# Altium schematic sheet LevelShiftingExtGPIO.SchDoc
size A4; CompanyName: Technische Hochschule Nürnberg Georg Simon Ohm; Organization: UltraZohm; Address1: Kesslerplatz 12; Address2: 90489 Nürnberg; Address3: GERMANY; Website: www.ultrazohm.com
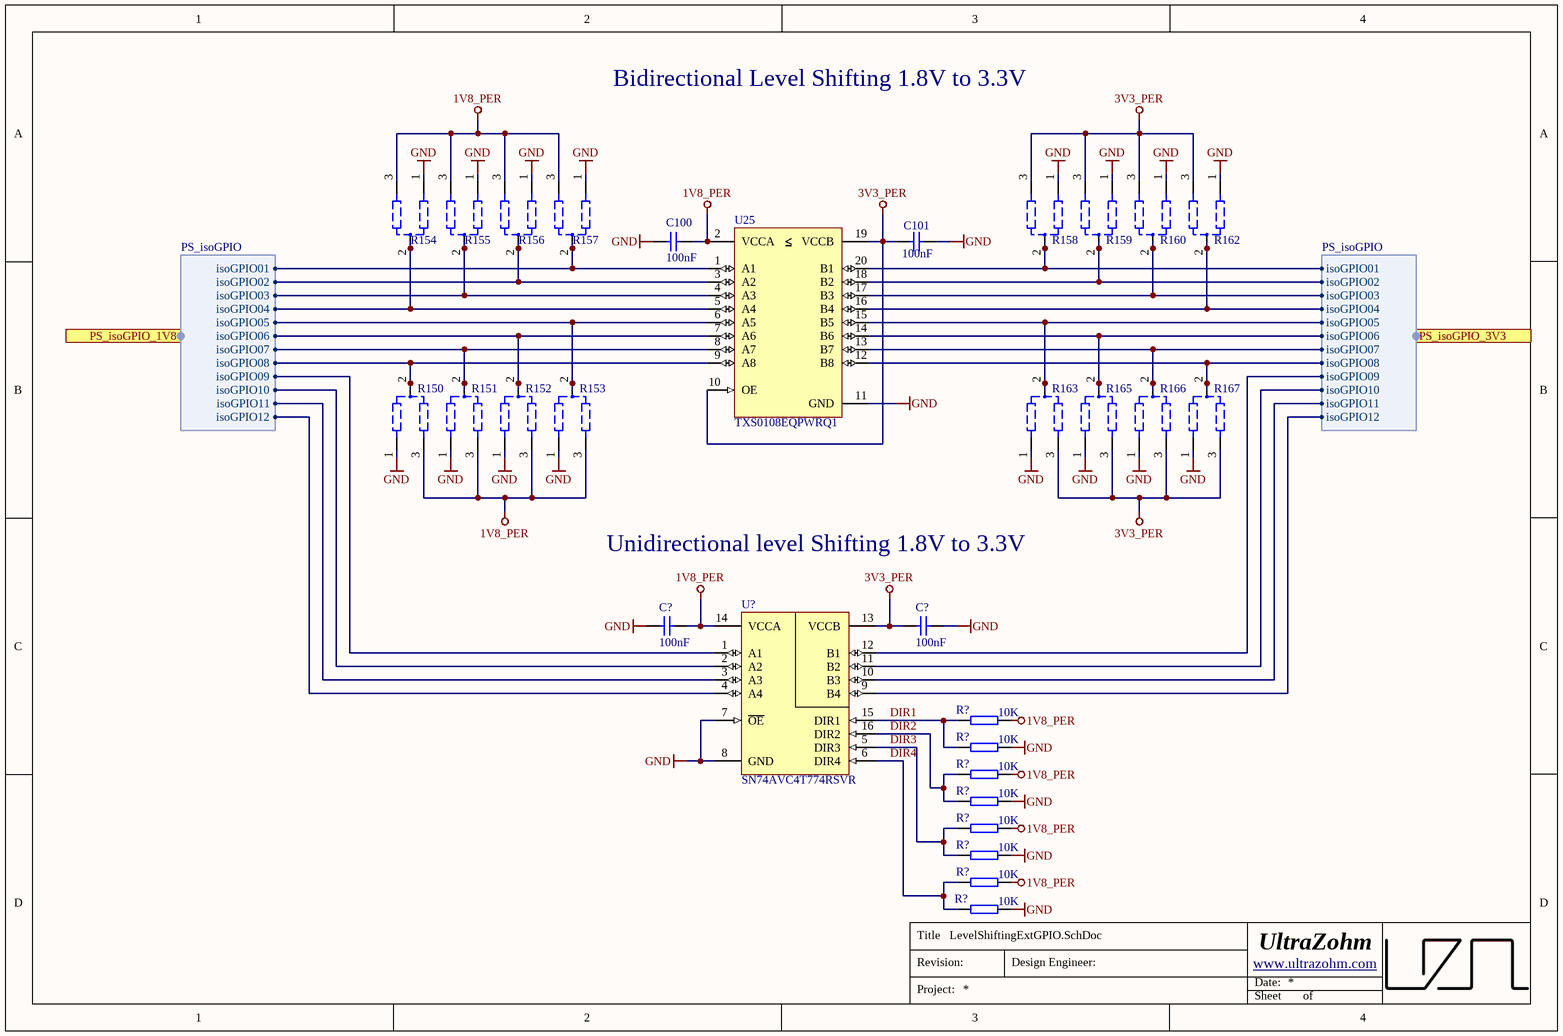
[diagram p0: LevelShiftingExtGPIO.SchDoc]

## Parts
(Parts that share a designator on the sheet are numbered #1, #2 ... from top to bottom, then left to right.)
C100  100nF  [CAPC1608X90N_V]
C101  100nF  [CAPC1608X90N_V]
C?#1  100nF  [CAPC1608X90N_V]
C?#2  100nF  [CAPC1608X90N_V]
R150  Manual Assembly 1608 (0603)  [TP_DUAL_RES_0603]  (value not drawn)  (no BOM)
R151  Manual Assembly 1608 (0603)  [TP_DUAL_RES_0603]  (value not drawn)  (no BOM)
R152  Manual Assembly 1608 (0603)  [TP_DUAL_RES_0603]  (value not drawn)  (no BOM)
R153  Manual Assembly 1608 (0603)  [TP_DUAL_RES_0603]  (value not drawn)  (no BOM)
R154  Manual Assembly 1608 (0603)  [TP_DUAL_RES_0603]  (value not drawn)  (no BOM)
R155  Manual Assembly 1608 (0603)  [TP_DUAL_RES_0603]  (value not drawn)  (no BOM)
R156  Manual Assembly 1608 (0603)  [TP_DUAL_RES_0603]  (value not drawn)  (no BOM)
R157  Manual Assembly 1608 (0603)  [TP_DUAL_RES_0603]  (value not drawn)  (no BOM)
R158  Manual Assembly 1608 (0603)  [TP_DUAL_RES_0603]  (value not drawn)  (no BOM)
R159  Manual Assembly 1608 (0603)  [TP_DUAL_RES_0603]  (value not drawn)  (no BOM)
R160  Manual Assembly 1608 (0603)  [TP_DUAL_RES_0603]  (value not drawn)  (no BOM)
R162  Manual Assembly 1608 (0603)  [TP_DUAL_RES_0603]  (value not drawn)  (no BOM)
R163  Manual Assembly 1608 (0603)  [TP_DUAL_RES_0603]  (value not drawn)  (no BOM)
R165  Manual Assembly 1608 (0603)  [TP_DUAL_RES_0603]  (value not drawn)  (no BOM)
R166  Manual Assembly 1608 (0603)  [TP_DUAL_RES_0603]  (value not drawn)  (no BOM)
R167  Manual Assembly 1608 (0603)  [TP_DUAL_RES_0603]  (value not drawn)  (no BOM)
R?#1  10K  [RESC1608X55N_V]
R?#2  10K  [RESC1608X55N_V]
R?#3  10K  [RESC1608X55N_V]
R?#4  10K  [RESC1608X55N_V]
R?#5  10K  [RESC1608X55N_V]
R?#6  10K  [RESC1608X55N_V]
R?#7  10K  [RESC1608X55N_V]
R?#8  10K  [RESC1608X55N_V]
U25  TXS0108EQPWRQ1  [SOP65P640X120-20N]
U?  SN74AVC4T774RSVR  [QFN40P260X180X55-16N]

## Ports
PS_isoGPIO_1V8 (harness PS_isoGPIO), PS_isoGPIO_3V3 (harness PS_isoGPIO)

## Harnesses
PS_isoGPIO: isoGPIO01, isoGPIO02, isoGPIO03, isoGPIO05, isoGPIO04, isoGPIO07, isoGPIO08, isoGPIO09, isoGPIO06, isoGPIO10, isoGPIO11, isoGPIO12

## Nets
1V8_PER: C100.1 C?#1.1 R150.3 R151.3 R152.3 R153.3 R154.3 R155.3 R156.3 R157.3 R?#1.2 R?#3.2 R?#5.2 R?#7.2 U25.2(VCCA) U?.14(VCCA)
3V3_PER: C101.1 C?#2.2 R158.3 R159.3 R160.3 R162.3 R163.3 R165.3 R166.3 R167.3 U25.10(OE) U25.19(VCCB) U?.13(VCCB)
GND: C100.2 C101.2 C?#1.2 C?#2.1 R150.1 R151.1 R152.1 R153.1 R154.1 R155.1 R156.1 R157.1 R158.1 R159.1 R160.1 R162.1 R163.1 R165.1 R166.1 R167.1 R?#2.2 R?#4.2 R?#6.2 R?#8.2 U25.11(GND) U?.7(~{OE}) U?.8(GND)
DIR1: R?#1.1 R?#2.1 U?.15(DIR1)
DIR2: R?#3.1 R?#4.1 U?.16(DIR2)
DIR3: R?#5.1 R?#6.1 U?.5(DIR3)
DIR4: R?#7.1 R?#8.1 U?.6(DIR4)
NetR150_2: R150.2 U25.9(A8) ; port PS_isoGPIO_1V8.isoGPIO08
NetR151_2: R151.2 U25.8(A7) ; port PS_isoGPIO_1V8.isoGPIO07
NetR152_2: R152.2 U25.7(A6) ; port PS_isoGPIO_1V8.isoGPIO06
NetR153_2: R153.2 U25.6(A5) ; port PS_isoGPIO_1V8.isoGPIO05
NetR154_2: R154.2 U25.5(A4) ; port PS_isoGPIO_1V8.isoGPIO04
NetR155_2: R155.2 U25.4(A3) ; port PS_isoGPIO_1V8.isoGPIO03
NetR156_2: R156.2 U25.3(A2) ; port PS_isoGPIO_1V8.isoGPIO02
NetR157_2: R157.2 U25.1(A1) ; port PS_isoGPIO_1V8.isoGPIO01
NetR158_2: R158.2 U25.20(B1) ; port PS_isoGPIO_3V3.isoGPIO01
NetR159_2: R159.2 U25.18(B2) ; port PS_isoGPIO_3V3.isoGPIO02
NetR160_2: R160.2 U25.17(B3) ; port PS_isoGPIO_3V3.isoGPIO03
NetR162_2: R162.2 U25.16(B4) ; port PS_isoGPIO_3V3.isoGPIO04
NetR163_2: R163.2 U25.15(B5) ; port PS_isoGPIO_3V3.isoGPIO05
NetR165_2: R165.2 U25.14(B6) ; port PS_isoGPIO_3V3.isoGPIO06
NetR166_2: R166.2 U25.13(B7) ; port PS_isoGPIO_3V3.isoGPIO07
NetR167_2: R167.2 U25.12(B8) ; port PS_isoGPIO_3V3.isoGPIO08
NetU?_1: U?.1(A1) ; port PS_isoGPIO_1V8.isoGPIO09
NetU?_2: U?.2(A2) ; port PS_isoGPIO_1V8.isoGPIO10
NetU?_3: U?.3(A3) ; port PS_isoGPIO_1V8.isoGPIO11
NetU?_4: U?.4(A4) ; port PS_isoGPIO_1V8.isoGPIO12
NetU?_9: U?.9(B4) ; port PS_isoGPIO_3V3.isoGPIO12
NetU?_10: U?.10(B3) ; port PS_isoGPIO_3V3.isoGPIO11
NetU?_11: U?.11(B2) ; port PS_isoGPIO_3V3.isoGPIO10
NetU?_12: U?.12(B1) ; port PS_isoGPIO_3V3.isoGPIO09

## Notes on the sheet
- Bidirectional Level Shifting 1.8V to 3.3V
- Unidirectional level Shifting 1.8V to 3.3V
- Title
- Revision:
- Design Engineer:
- Date:
- Project:
- Sheet
- of

## Library data of the parts
C100 C101 C?#1 C?#2 = 21382: KON 100nF 50V X7R ±10% SMD BF 1608 (0603); Value: 100n; AN: 21382; Mixed: SMT; Preferred: Yes; Temperature-Range: -55/+125; Tolerance: ±10%; Voltage: 50V; Technology: X7R; Case: 1608 (0603)
R150-R160 R162 R163 R165-R167 = 30792: Manual Assembly Resistors Placeholder 1608 (0603) Dual; AN: 30792; Mixed: MECH
R?#1-R?#8 = 21492: WID SMD 10K 1% 0,1W  BF 1608 (0603); AN: 21492; Mixed: SMT; Preferred: Yes; Tolerance: 1%; Case: 1608 (0603); Technology: TK100; Value: 10K
U25 = 30791: AN: 30791; Mixed: SMT; Temperature-Range: -40/+85; Extra: 8-Bit Bidirectional Voltage Translator for OD/Push-Pull; HelpURL: b:\AD\adlib\datasheet\TI\TXS0108E-Q1\; H-ART: TXS0108EQPWRQ1; Storage-Temperature: -65/+150(Abs); Case: TSSOP20
U? = 27170: AN: 27170; Mixed: SMT; Trenz-Stock: Yes; Extra: 4-Bit Dual-Supply Bus Transceiver With Configurable Voltage Translationand 3-Sta; HelpURL: B:\ad\adlib\datasheet\sn74avc4t774; Case: UQFN-16; H-ART: SN74AVC4T774RSVR